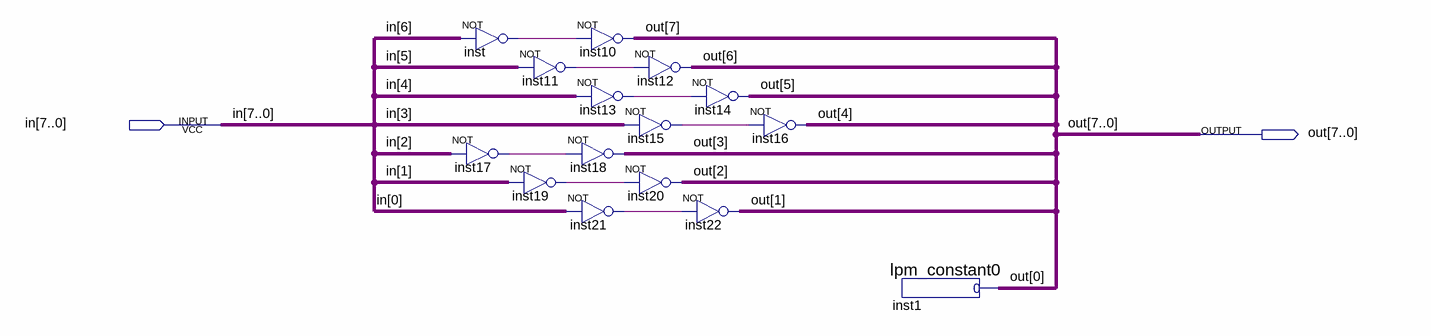
[diagram p0: schematic sheet]
// Quartus schematic LSL.bdf as structural Verilog: 15 symbols, 2 pins
module LSL (
  input  [7:0] in,
  output [7:0] out
);

  wire inst11_out, inst13_out, inst15_out, inst17_out, inst19_out, inst21_out, inst_out;

  not inst (inst_out, in[6]);
  not inst17 (inst17_out, in[2]);
  not inst10 (out[7], inst_out);
  not inst11 (inst11_out, in[5]);
  not inst13 (inst13_out, in[4]);
  not inst18 (out[3], inst17_out);
  not inst19 (inst19_out, in[1]);
  not inst21 (inst21_out, in[0]);
  not inst12 (out[6], inst11_out);
  not inst15 (inst15_out, in[3]);
  not inst20 (out[2], inst19_out);
  not inst14 (out[5], inst13_out);
  not inst22 (out[1], inst21_out);
  not inst16 (out[4], inst15_out);
  lpm_constant0 inst1 (.result(out[0]));
endmodule
